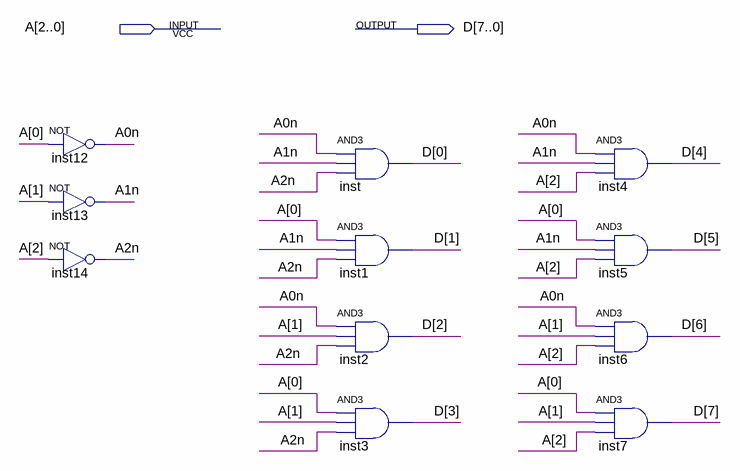
[diagram p0: schematic sheet]
// Quartus schematic decod_3_8.bdf as structural Verilog: 11 symbols, 2 pins
module decod_3_8 (
  input  [2:0] A,
  output [7:0] D
);

  wire A0n, A1n, A2n;

  not inst12 (A0n, A[0]);
  not inst13 (A1n, A[1]);
  not inst14 (A2n, A[2]);
  and inst (D[0], A0n, A1n, A2n);
  and inst1 (D[1], A[0], A1n, A2n);
  and inst2 (D[2], A0n, A[1], A2n);
  and inst3 (D[3], A[0], A[1], A2n);
  and inst4 (D[4], A0n, A1n, A[2]);
  and inst5 (D[5], A[0], A1n, A[2]);
  and inst6 (D[6], A0n, A[1], A[2]);
  and inst7 (D[7], A[0], A[1], A[2]);
endmodule
